# Altium schematic sheet AUX_Analog_IO.SchDoc: AUX analog connector
size 420 x 297 mm; Author: G.Kasprowicz; CompanyName: WUT ISE; DrawnBy: G.Kasprowicz; Organization: WUT ISE; Address1: PW ISE; Address2: Nowowiejska 15/19 00-665 Warsaw; Address3: gkasprow@gmail.com; DocumentNumber: 5; Revision: 1.0; SheetNumber: 5; SheetTotal: 36; ModifiedBy: -; CheckedDate: -; Title2: AUX analog connector; DivGrp: WUT ISE; Designer: G.Kasprowicz; ModifiedDate: -; ProjectName: Sensor Box
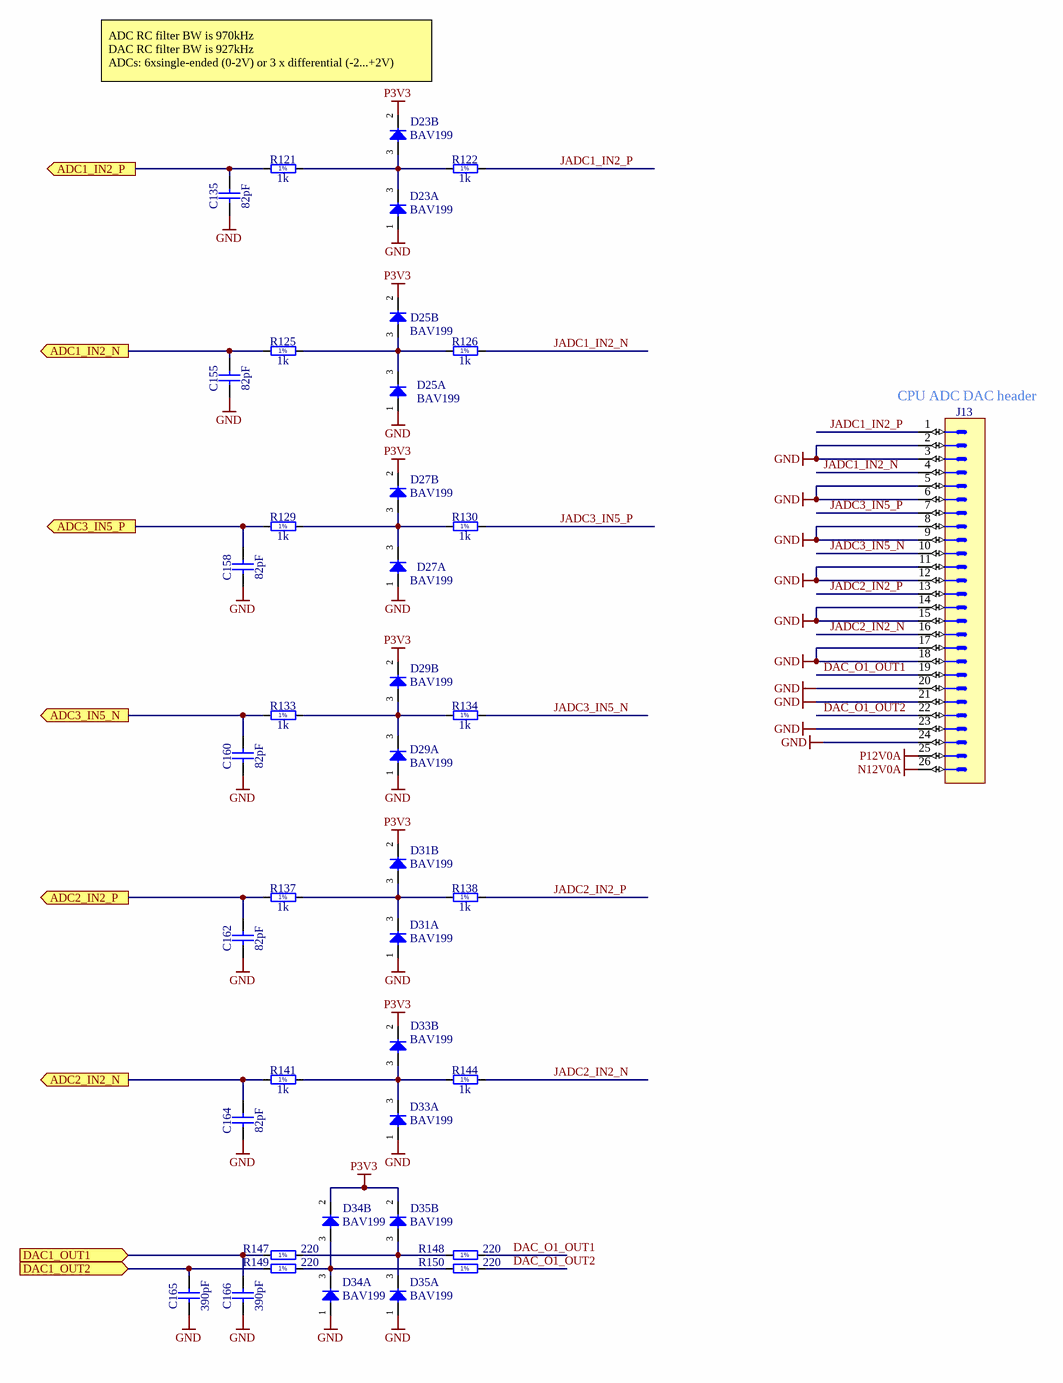
[diagram p0: AUX_Analog_IO.SchDoc]

## Parts
C135  82pF  [CAPC1608X87N]
C155  82pF  [CAPC1608X87N]
C158  82pF  [CAPC1608X87N]
C160  82pF  [CAPC1608X87N]
C162  82pF  [CAPC1608X87N]
C164  82pF  [CAPC1608X87N]
C165  390pF  [CAPC1608X87N]
C166  390pF  [CAPC1608X87N]
D23  BAV199  [SOT95P240X110-3N]  (parts A,B of 2)
D25  BAV199  [SOT95P240X110-3N]  (parts A,B of 2)
D27  BAV199  [SOT95P240X110-3N]  (parts A,B of 2)
D29  BAV199  [SOT95P240X110-3N]  (parts A,B of 2)
D31  BAV199  [SOT95P240X110-3N]  (parts A,B of 2)
D33  BAV199  [SOT95P240X110-3N]  (parts A,B of 2)
D34  BAV199  [SOT95P240X110-3N]  (parts A,B of 2)
D35  BAV199  [SOT95P240X110-3N]  (parts A,B of 2)
J13  Header 26  [3M_N2526-6002RB]  (value not drawn)
R121  1k  [RESC1005X40N]
R122  1k  [RESC1005X40N]
R125  1k  [RESC1005X40N]
R126  1k  [RESC1005X40N]
R129  1k  [RESC1005X40N]
R130  1k  [RESC1005X40N]
R133  1k  [RESC1005X40N]
R134  1k  [RESC1005X40N]
R137  1k  [RESC1005X40N]
R138  1k  [RESC1005X40N]
R141  1k  [RESC1005X40N]
R144  1k  [RESC1005X40N]
R147  220  [RESC1608X55N]
R148  220  [RESC1608X55N]
R149  220  [RESC1608X55N]
R150  220  [RESC1608X55N]

## Ports
ADC1_IN2_N (out), ADC1_IN2_P (out), ADC2_IN2_N (out), ADC2_IN2_P (out), ADC3_IN5_N (out), ADC3_IN5_P (out), DAC1_OUT1 (in), DAC1_OUT2 (in)

## Nets
GND: C135.1 C155.1 C158.1 C160.1 C162.1 C164.1 C165.1 C166.1 D23.1(A) D25.1(A) D27.1(A) D29.1(A) D31.1(A) D33.1(A) D34.1(A) D35.1(A) J13.2 J13.3 J13.5 J13.6 J13.8 J13.9 J13.11 J13.12 J13.14 J13.15 J13.17 J13.18 J13.20 J13.21 J13.23 J13.24
N12V0A: J13.26
P3V3: D23.2(C) D25.2(C) D27.2(C) D29.2(C) D31.2(C) D33.2(C) D34.2(C) D35.2(C)
P12V0A: J13.25
ADC1_IN2_N: C155.2 R125.1 ; port ADC1_IN2_N
ADC1_IN2_P: C135.2 R121.1 ; port ADC1_IN2_P
ADC2_IN2_N: C164.2 R141.1 ; port ADC2_IN2_N
ADC2_IN2_P: C162.2 R137.1 ; port ADC2_IN2_P
ADC3_IN5_N: C160.2 R133.1 ; port ADC3_IN5_N
ADC3_IN5_P: C158.2 R129.1 ; port ADC3_IN5_P
DAC1_OUT1: C166.2 R147.1 ; port DAC1_OUT1
DAC1_OUT2: C165.2 R149.1 ; port DAC1_OUT2
DAC_O1_OUT1: J13.19 R148.2
DAC_O1_OUT2: J13.22 R150.2
JADC1_IN2_N: J13.4 R126.2
JADC1_IN2_P: J13.1 R122.2
JADC2_IN2_N: J13.16 R144.2
JADC2_IN2_P: J13.13 R138.2
JADC3_IN5_N: J13.10 R134.2
JADC3_IN5_P: J13.7 R130.2
NetD23_3: D23.3(COMAC) R121.2 R122.1
NetD25_3: D25.3(COMAC) R125.2 R126.1
NetD27_3: D27.3(COMAC) R129.2 R130.1
NetD29_3: D29.3(COMAC) R133.2 R134.1
NetD31_3: D31.3(COMAC) R137.2 R138.1
NetD33_3: D33.3(COMAC) R141.2 R144.1
NetD34_3: D34.3(COMAC) R149.2 R150.1
NetD35_3: D35.3(COMAC) R147.2 R148.1

## Notes on the sheet
- (near D23) ADC RC filter BW is 970kHz
  DAC RC filter BW is 927kHz
  ADCs: 6xsingle-ended (0-2V) or 3 x differential (-2...+2V)
- (near J13) CPU ADC DAC header
- Project/Equipment
- Document
- Designer
- Drawn by
- Check.by
- Copyright WUT ISE 2018.
  This documentation describes Open Hardware and is licensed under the CERN OHL v.1.1. You may redistribute and modify this documentation under the terms of the CERN OHL v.1.1. (http://ohwr.org/CERNOHL). This documentation is distributed WITHOUT ANY EXPRESS OR IMPLIED WARRANTY, INCLUDING OF MERCHANTABILITY, SATISFACTORY QUALITY AND FITNESS FOR A PARTICULAR PURPOSE. Please see the CERN OHL v.1.1 for applicable conditions.
- Contact
- File
- Last Mod.
- Print Date
- Sheet
- Size
- A3
- of
- Rev
- (in symbol R0402_1K_1%_0.0625W_100PPM) 1%
- (in symbol R0603_220R_1%_0.1W_100PPM) 1%

## Library data of the parts
C135 C155 C158 C160 C162 C164 = CC0603_82PF_50V_5%_NP0: Non-polarised capacitor; Part Description: SMD Multilayer Chip Ceramic Capacitor; Manufacturer: GENERIC; Manufacturer1 Part Number: 223886715829; Voltage: 50V; TC: C0G/NP0; Tolerance: ±5%; Part Number: CC0603_82PF_50V_5%_NP0; Component Kind: Standard; Component Type: Standard; Pin Count: 2; Value: 82pF; Status: Preferred; Manufacturer Part Number: CC0603_82PF_50V_5%_NP0; Case: 0603; Mounted: Yes; Socket: No; SMD: Yes; Sense: No; Manufacturer1 Example: PHYCOMP; Manufacturer1 ComponentHeight: 0.87mm; HelpURL: \\cern.ch\dfs\Applications\Altium\Datasheets\CC0603_NP0_PHYCOMP.pdf; Author: CERN DEM JLC; CreateDate: 03.12.2007; LatestRevisionDate: 03.12.2007
C165 C166 = CC0603_390PF_50V_5%_NP0: Non-polarised capacitor; Part Description: SMD Multilayer Chip Ceramic Capacitor; Manufacturer: GENERIC; Manufacturer1 Part Number: 223886715391; Voltage: 50V; TC: NP0; Tolerance: ±5%; Part Number: CC0603_390PF_50V_5%_NP0; Component Kind: Standard; Component Type: Standard; Pin Count: 2; Value: 390pF; Status: Preferred; Manufacturer Part Number: CC0603_390PF_50V_5%_NP0; Case: 0603; Mounted: Yes; Socket: No; SMD: Yes; Sense: No; Manufacturer1 Example: PHYCOMP; Manufacturer1 ComponentHeight: 0.87mm; HelpURL: \\cern.ch\dfs\Applications\Altium\Datasheets\CC0603_NP0_PHYCOMP.pdf; Author: CERN DEM JLC; CreateDate: 03.12.2007; LatestRevisionDate: 03.12.2007
D23 D25 D27 D29 D31 D33-D35 = BAV199: Serial Diode; Part Description: Low-Leakage Double Diode; Manufacturer: NXP SEMICONDUCTORS; Voltage: 75V; Power: 250mW; PressFit: No; Bonding: No; Part Number: BAV199; Component Kind: Standard; Component Type: Standard; Device: BAV199; PackageDescription: SOT23 3-Leads, Pitch 0.95mm - Body 1.4x3mm, IPC Medium Density; Manufacturer Part Number: BAV199; Pin Count: 3; Case: SOT23-3; Mounted: Yes; Socket: No; SMD: Yes; Sense: No; ComponentHeight: 1.1mm; HelpURL: \\cern.ch\dfs\Applications\Altium\Datasheets\BAV199.pdf; Author: CERN DEM JMW; CreateDate: 2008-11-21; LatestRevisionDate: 2008-11-21
J13 = 3M_N2526-6002RB: Connector 26 Male; Part Description: 26 Contacts - Straight .100'' x .100'' Low Profile Four-Wall Header, 2500 Series; Manufacturer: 3M; PressFit: No; Part Number: 3M_N2526-6002RB; Component Kind: Standard; Component Type: Standard; Pin Count: 26; Family: Header 26; Mounted: Yes; Socket: No; SMD: No; Sense: No; Status: None; Manufacturer Part Number: N2526-6002RB; ComponentHeight: 10.03mm; HelpURL: \\cern.ch\dfs\Applications\Altium\Datasheets\3M_N2526-6002RB.pdf; Author: CERN DEM JLC; CreateDate: 11.02.2009; LatestRevisionDate: 11.08.2009
R121 R122 R125 R126 R129 R130 R133 R134 R137 R138 R141 R144 = R0402_1K_1%_0.0625W_100PPM: Resistor - 1%; Part Description: General Purpose Thick Film Chip Resistor; Manufacturer: GENERIC; Manufacturer1 Part Number: 232270671002L; TC: ±100ppm/°C; PressFit: No; Part Number: R0402_1K_1%_0.0625W_100PPM; Component Kind: Standard; Component Type: Standard; Pin Count: 2; Value: 1k; Status: Not Recommended; Power: 0.0625W; Tolerance: ±1%; Manufacturer Part Number: R0402_1K_1%_0.0625W_100PPM; Case: 0402; Mounted: Yes; Sense: No; Socket: No; SMD: Yes; Manufacturer1 Example: YAGEO PHYCOMP; Manufacturer1 ComponentHeight: 0.4mm; HelpURL: \\cern.ch\dfs\Applications\Altium\Datasheets\R0402_Phycomp_RC0402.pdf; Author: CERN DEM JLC; CreateDate: 03/12/2007; LatestRevisionDate: 17/10/2012
R147-R150 = R0603_220R_1%_0.1W_100PPM: Resistor - 1%; Part Description: General Purpose Thick Film Chip Resistor; Manufacturer: GENERIC; Manufacturer1 Part Number: NRC06F2200TRF; Power: 0.1W; TC: ±100ppm/°C; PressFit: No; Part Number: R0603_220R_1%_0.1W_100PPM; Component Kind: Standard; Component Type: Standard; Pin Count: 2; Value: 220; Status: Preferred; Tolerance: ±1%; Manufacturer Part Number: R0603_220R_1%_0.1W_100PPM; Case: 0603; Mounted: Yes; Sense: No; Socket: No; SMD: Yes; Manufacturer1 Example: NIC COMPONENT; Manufacturer1 ComponentHeight: 0.55mm; HelpURL: \\cern.ch\dfs\Applications\Altium\Datasheets\R0603_NIC_NRC.pdf; Author: CERN DEM JLC; CreateDate: 03/12/2007; LatestRevisionDate: 13/03/2008